# Altium schematic sheet 01_COVER.SchDoc
size 420 x 297 mm; Web: www.byte-lab.com; PageNumber: 01
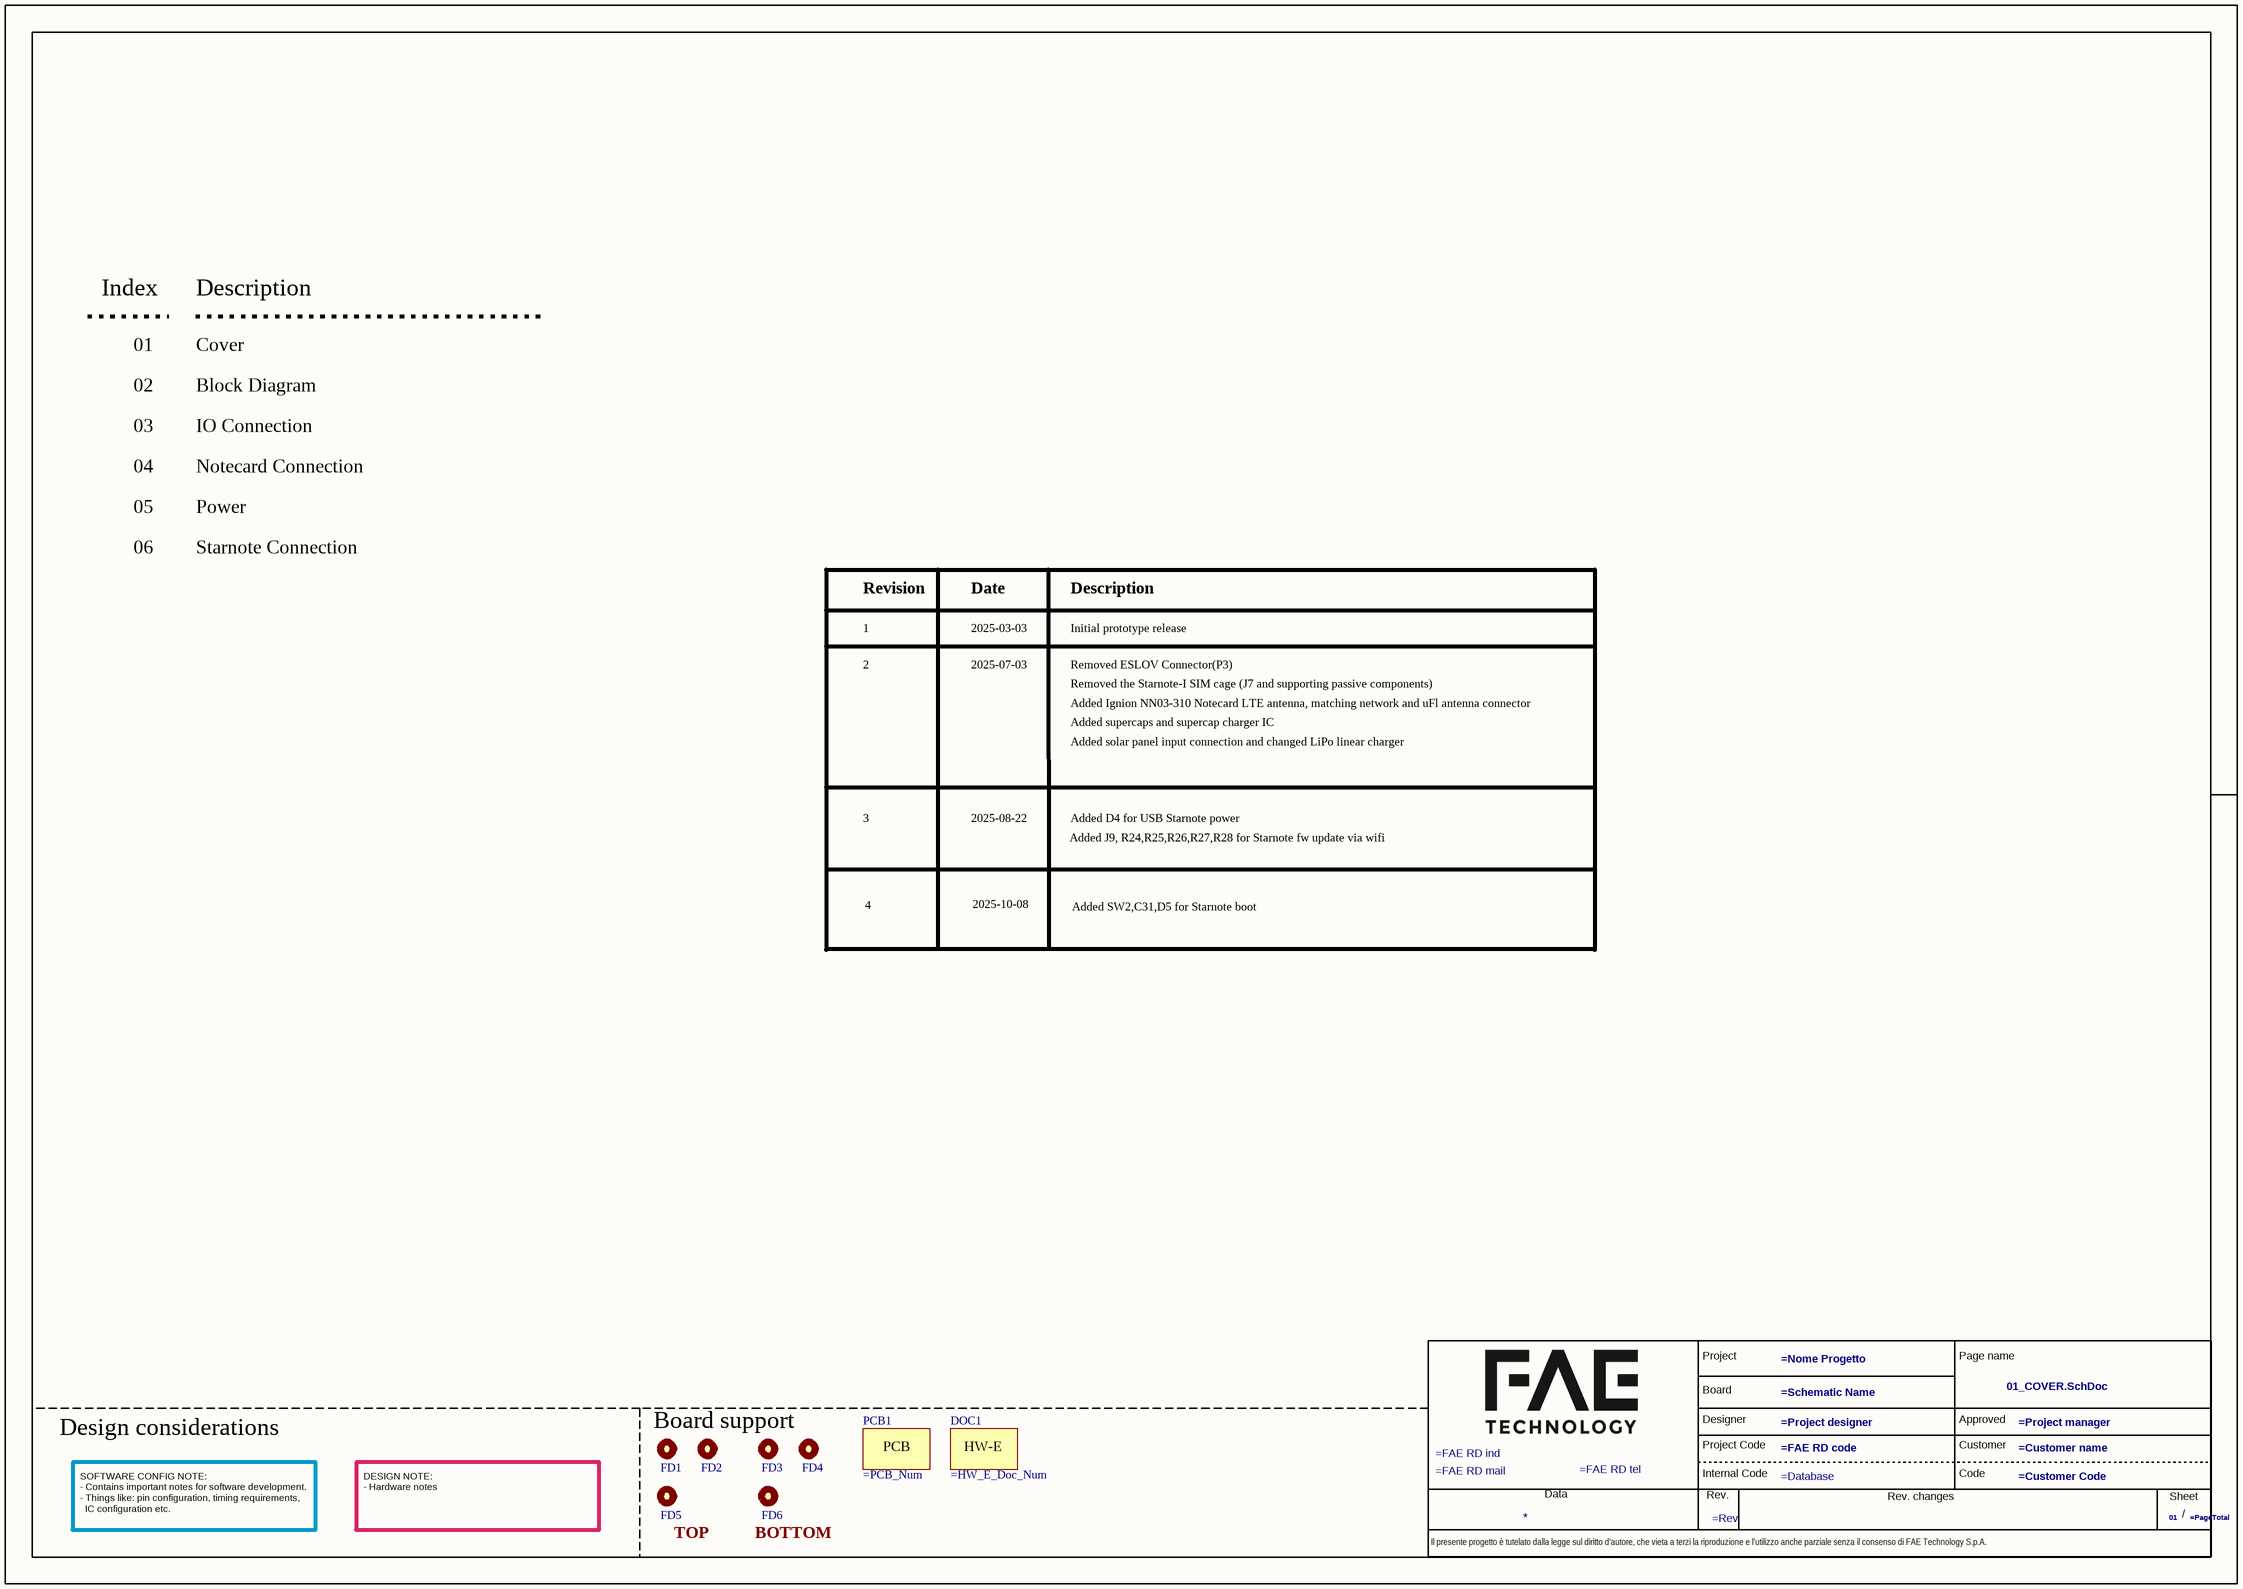
[diagram p0: 01_COVER.SchDoc]

## Parts
?  (no value)  (graphical)
DOC1  Electronic design doc number  (value not drawn)  (mechanical)
FD1  Fiducial mark  [Fiducial mark 1mm]  (value not drawn)  (no BOM)
FD2  Fiducial mark  [Fiducial mark 1mm]  (value not drawn)  (no BOM)
FD3  Fiducial mark  [Fiducial mark 1mm]  (value not drawn)  (no BOM)
FD4  Fiducial mark  [Fiducial mark 1mm]  (value not drawn)  (no BOM)
FD5  Fiducial mark  [Fiducial mark 1mm]  (value not drawn)  (no BOM)
FD6  Fiducial mark  [Fiducial mark 1mm]  (value not drawn)  (no BOM)
PCB1  PCB Part Number  (value not drawn)  (mechanical)

## Nets

Not connected (* = marked no-connect by the designer): FD1 1; FD2 1; FD3 1; FD4 1; FD5 1; FD6 1

## Notes on the sheet
- Index
- Description
- 01
- 02
- Cover
- Block Diagram
- 03
- IO Connection
- 04
- 05
- Notecard Connection
- Power
- 06
- Starnote Connection
- Revision
- Date
- 2
- 1
- 2025-07-03
- 2025-03-03
- Removed ESLOV Connector(P3)
- Initial prototype release
- Removed the Starnote-I SIM cage (J7 and supporting passive components)
- Added Ignion NN03-310 Notecard LTE antenna, matching network and uFl antenna connector
- Added supercaps and supercap charger IC
- Added solar panel input connection and changed LiPo linear charger
- 3
- 2025-08-22
- Added J9, R24,R25,R26,R27,R28 for Starnote fw update via wifi
- Added D4 for USB Starnote power
- 4
- 2025-10-08
- Added SW2,C31,D5 for Starnote boot
- Design considerations
- Board support
- SOFTWARE CONFIG NOTE:
  - Contains important notes for software development.
  - Things like: pin configuration, timing requirements,
  IC configuration etc.
- DESIGN NOTE:
  - Hardware notes
- (near FD5) TOP
- (near FD6) BOTTOM
- Board
- Project
- Page name
- Project Code
- Designer
- Internal Code
- Approved
- Customer
- Code
- Il presente progetto è tutelato dalla legge sul diritto d'autore, che vieta a terzi la riproduzione e l'utilizzo anche parziale senza il consenso di FAE Technology S.p.A.
- Data
- Rev.
- Rev. changes
- Sheet
- /
- (in symbol PN_HW-E) HW-E
- (in symbol PN_PCB) PCB

## Library data of the parts
? = MyFAETechnology
DOC1 = PN_HW-E: Manufacturer: Byte Lab; Checked_By: Zvonc; Drawn_By: Dodig; Manufacturer Part Number: *; DateModified: *; BL Part Number: =HW_E_Doc_Num
FD1-FD6 = Fiducial mark: Drawn_By: Puskar; Checked_By: Dodig; BL Part Number: N/A; Manufacturer: N/A; Manufacturer Part Number: N/A; DateModified: 17-06-2013
PCB1 = PN_PCB: Manufacturer: Byte Lab; Checked_By: Zvonc; Drawn_By: Dodig; Manufacturer Part Number: *; DateModified: *; BL Part Number: =PCB_Num